# Altium project lab_1_somov_usb_i2c.PrjPcb
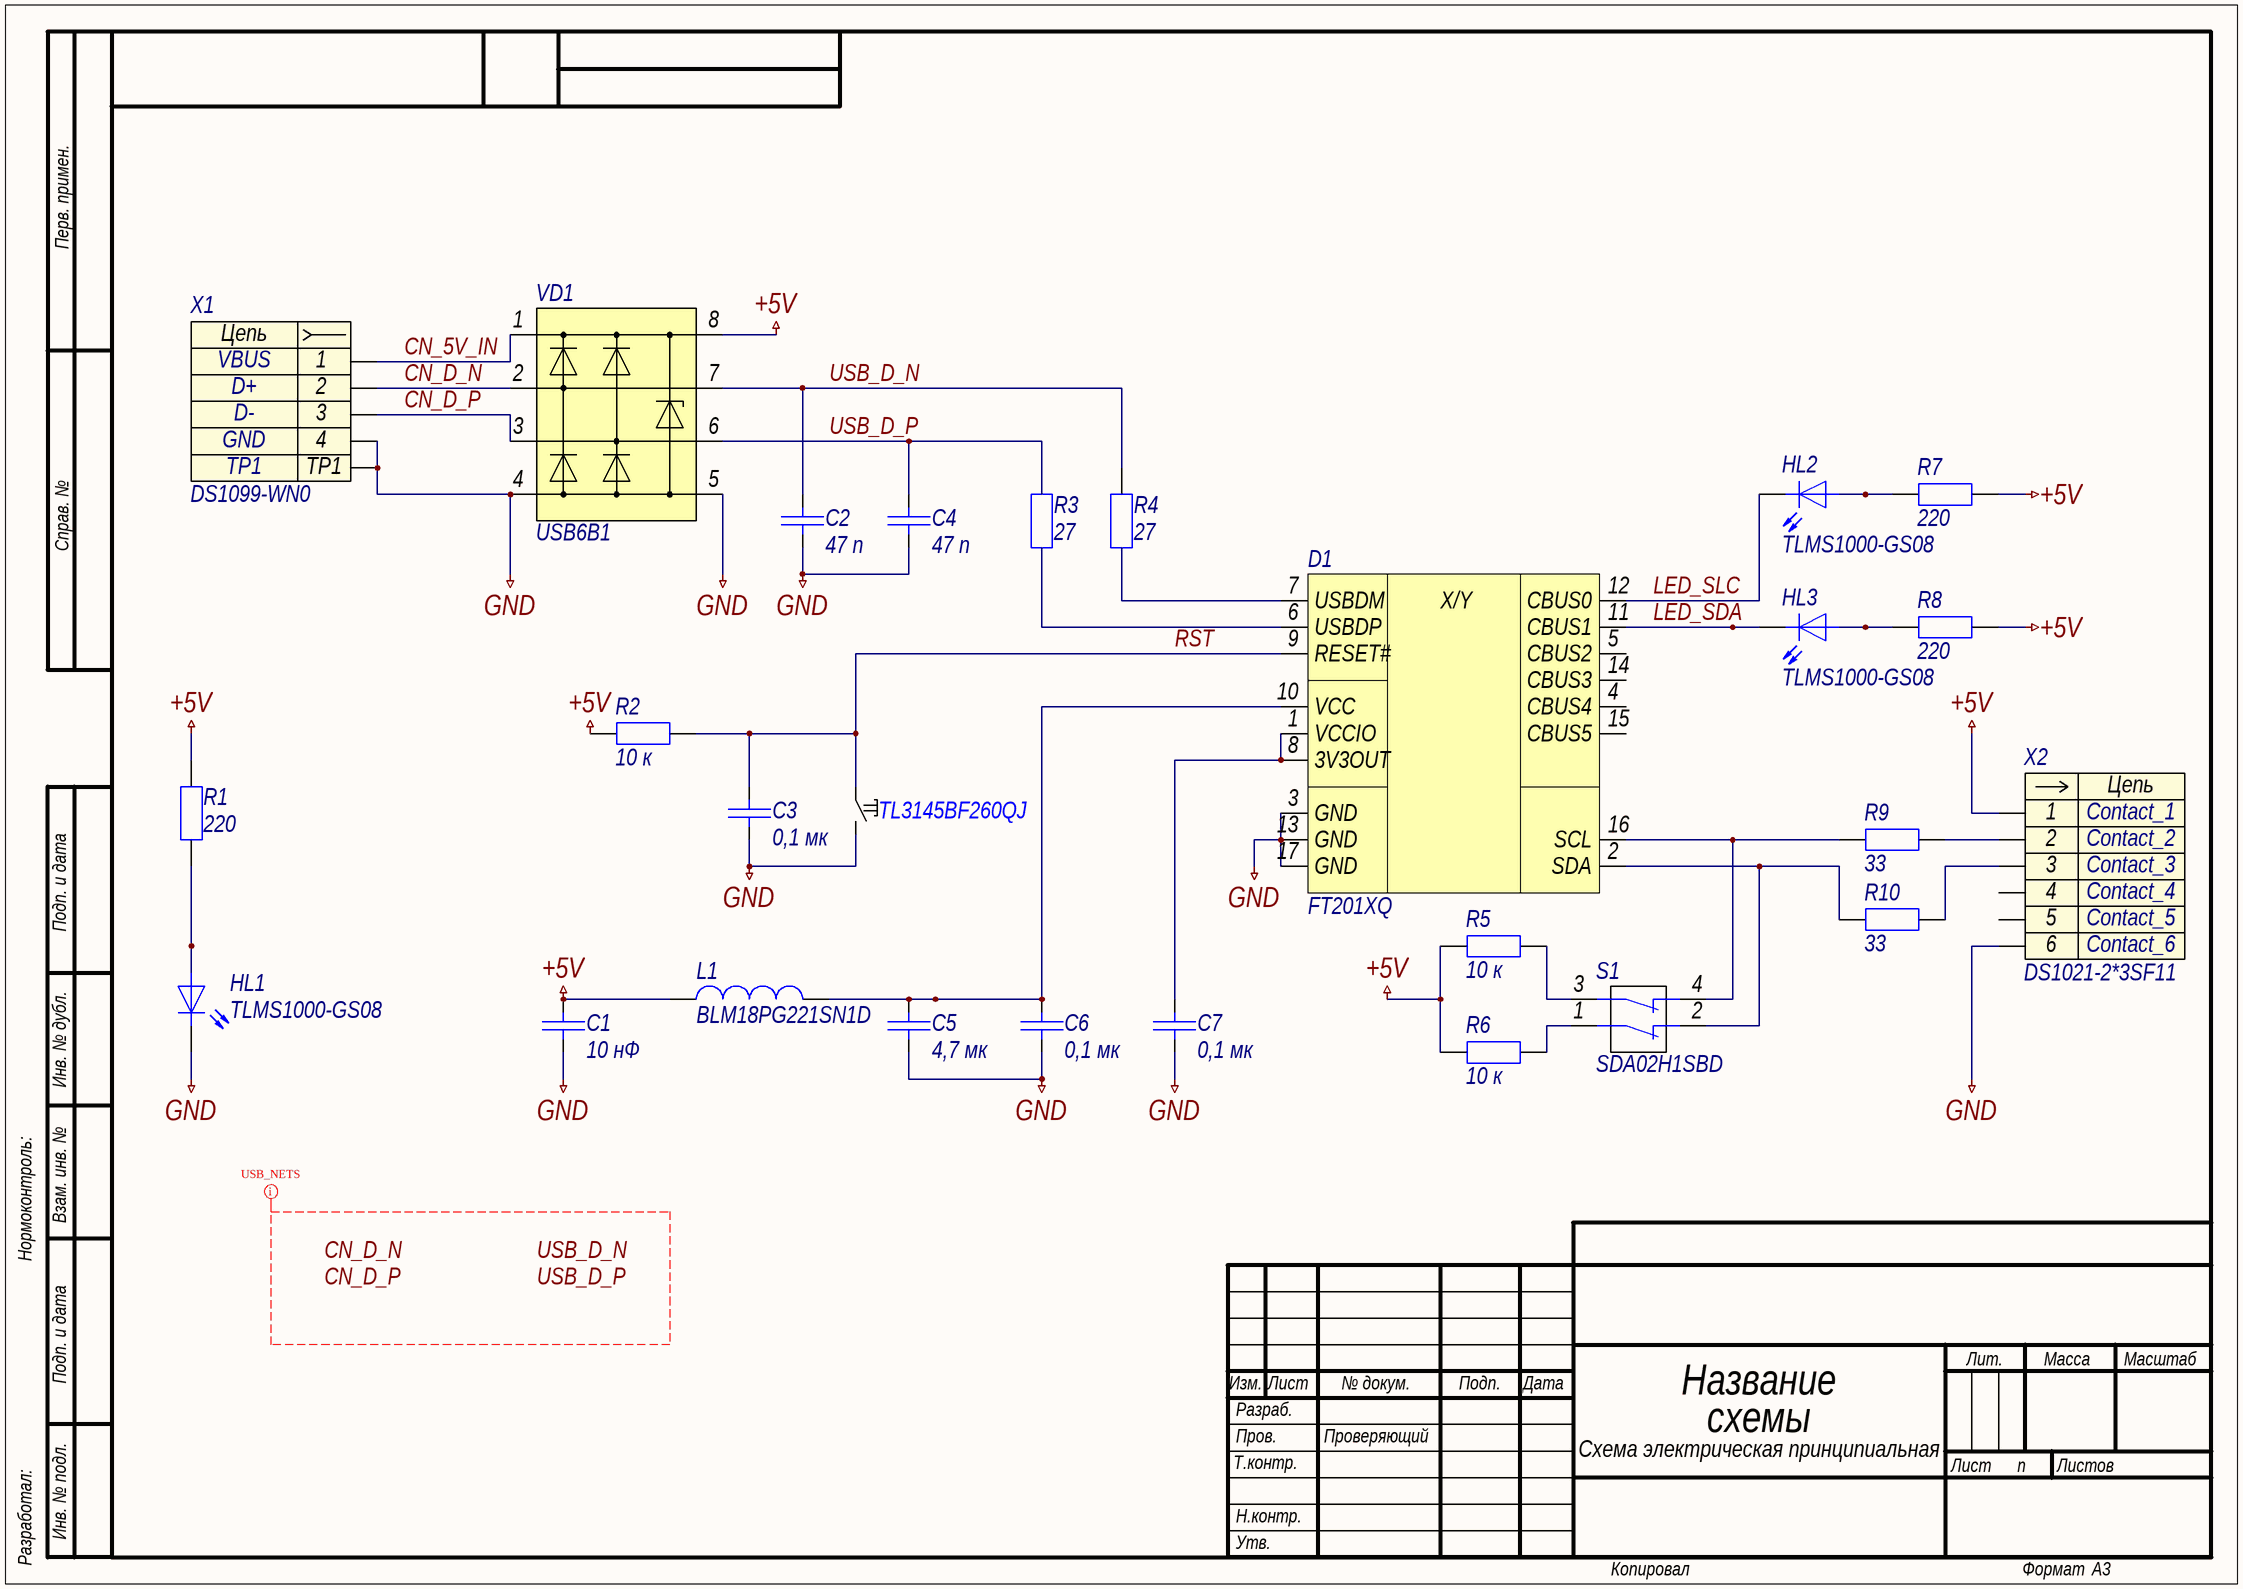
[diagram p0: lab_1_somov_usb_i2c.SchDoc]
approver: Утвердил; check: Проверяющий; designation: Введите номер сборки; developer: Разработчик; document_code: Ý3; document_type: Схема электрическая принципиальная; pcb_dec_number: Введите номер платы; project: Введите название проекта; sheets_total: M; title: Введите полное название схемы; title_line_1: Название; title_line_2: схемы
1 sheet, 27 parts. Net scope: global (net labels, ports and power ports of the same name join across sheets).
Board file: lab_1_somov_usb_i2c.PcbDoc

## Sheet lab_1_somov_usb_i2c.SchDoc: Введите полное название схемы
size 420 x 297 mm; ApprovedBy: Утвердил; CheckedBy: Проверяющий; DrawnBy: Разработчик; DocumentNumber: Ââåäèòå íîìåð ñáîðêèÝ3; SheetNumber: n; SheetTotal: M; DocumentCode: Ý3; ImagePath: Введите номер платы

### Parts
C1  10 нФ  [C0402]
C2  47 п  [C0201]
C3  0,1 мк  [C0603]
C4  47 п  [C0201]
C5  4,7 мк  [C0603]
C6  0,1 мк  [C0603]
C7  0,1 мк  [C0603]
D1  FT201XQ  [FT201XQ]
HL1  TLMS1000-GS08  [HL0603]
HL2  TLMS1000-GS08  [HL0603]
HL3  TLMS1000-GS08  [HL0603]
L1  BLM18PG221SN1D  [BLM-2-0603]
R1  220  [R0603]
R2  10 к  [R0603]
R3  27  [R27]
R4  27  [R27]
R5  10 к  [R0603]
R6  10 к  [R0603]
R7  220  [R0603]
R8  220  [R0603]
R9  33  [R0603]
R10  33  [R0603]
S1  SDA02H1SBD  [DIP-SWITCH-02-706X930X545]
TL3145BF260QJ  (no value)  [BUT: 3x4x2 SMT]
VD1  USB6B1  [SO-8]
X1  DS1099-WN0  [DS1099-WN0]
X2  DS1021-2*3SF11  [DS1021-2X3SF11]

### Nets
+5V: C1.1 L1.1 R1.2 R2.1 R5.1 R6.1 R7.2 R8.2 VD1.8 X2.1
GND: C1.2 C2.2 C3.2 C4.2 C5.2 C6.2 C7.2 D1.3(GND) D1.13(GND) D1.17(GND) HL1.1 TL3145BF260QJ.2 VD1.4 VD1.5 X1.4 X1.TP1 X2.6
CN_5V_IN: VD1.1 X1.1
CN_D_N: VD1.2 X1.2
CN_D_P: VD1.3 X1.3
LED_SDA: D1.11(CBUS1) HL3.1
LED_SLC: D1.12(CBUS0) HL2.1
RST: C3.1 D1.9(RESET#) R2.2 TL3145BF260QJ.1
USB_D_N: C2.1 VD1.7
USB_D_P: C4.1 R3.2 VD1.6
NetC5_1: C5.1 C6.1 D1.10(VCC) L1.2
NetC7_1: C7.1 D1.1(VCCIO) D1.8(3V3OUT)
NetD1_2: D1.2(SDA) R10.1 S1.2
NetD1_6: D1.6(USBDP) R3.1
NetD1_7: D1.7(USBDM) R4.1
NetD1_16: D1.16(SCL) R9.1 S1.4
NetHL1_2: HL1.2 R1.1
NetHL2_2: HL2.2 R7.1
NetHL3_2: HL3.2 R8.1
NetR5_2: R5.2 S1.3
NetR6_2: R6.2 S1.1
NetR9_2: R9.2 X2.2
NetR10_2: R10.2 X2.3

Not connected (* = marked no-connect by the designer): D1 4(CBUS4) 5(CBUS2) 14(CBUS3) 15(CBUS5); R4 2; X2 4 5

### Layout directives
rule Differential Pairs Routing [Pref Gap = 0.254mm    Min Gap  = 0.15mm    Max Gap  = 0.254mmPref Width = 0.381mm    Min Width  = 0.155mm    Max Width  = 0.381mm]; net class USB_SIGNALS: CN_D_N, CN_D_P, USB_D_N, USB_D_P

### Notes on the sheet
- Labels drawn without touching a wire or pin: CN_D_N, CN_D_P, USB_D_N, USB_D_P
- Перв. примен.
- Справ. №
- Подп. и дата
- Инв. № дубл.
- Нормоконтроль:
- Взам. инв. №
- Изм.
- Лист
- № докум.
- Подп.
- Дата
- Лит.
- Масса
- Масштаб
- Т.контр.
- Пров.
- Разраб.
- Листов
- Разработал:
- Инв. № подл.
- Н.контр.
- Утв.
- Копировал
- Формат
- А3
- (in symbol FT201XQ) X/Y
- (in symbol x0003) Цепь
- (in symbol x0005) Цепь

### Library data of the parts
C1 = c0004: =Описание; ID: c0004; Фамилия: Соколов; Описание: Конденсатор чип 0402 10 нФ 50 В ±10 %; Наименование: CL05B103KB5NNNC; Производитель: Samsung electro-mechanics; Отклонение: ±10 %; Номинальное напряжение: 50 В; Рабочие температуры: от -55 °С до +125 °С; Корпус: 0402; Номинал: 10 нФ; HelpURL: http://product.samsungsem.com/mlcc/CL05C101FB5NNN.do
C2 C4 = c0002: =Описание; ID: c0002; Фамилия: Козлов; Описание: Конденсатор чип 0201 47 пФ 25 В ±5 %; Наименование: CL03C470JA3NNNC; Производитель: Samsung electro-mechanics; Отклонение: ±5 %; Номинальное напряжение: 25 В; Рабочие температуры: от -55 °С до +125 °С; Корпус: 0201; Номинал: 47 п; HelpURL: http://product.samsungsem.com/mlcc/CL03C470JA3NNN.do
C3 C6 C7 = c0005: =Описание; ID: c0005; Фамилия: Ларионов; Описание: Конденсатор чип 0603 0,1 мкФ 50 В ±5 %; Наименование: CC0603JRX7R9BB104; Производитель: Yageo; Отклонение: ±5 %; Номинальное напряжение: 50 В; Рабочие температуры: от -55 °С до +125 °С; Корпус: 0603; Номинал: 0,1 мк; HelpURL: https://www.yageo.com/upload/media/product/products/datasheet/mlcc/UPY-GPHC_X7R_6.3V-to-50V_20.pdf
C5 = c0009: =Описание; ID: c0009; Фамилия: Ларионов; Описание: Конденсатор чип 0603 4,7 мкФ 25 В ±10 %; Наименование: CC0603KRX5R8BB475; Производитель: Yageo; Отклонение: ±10 %; Номинальное напряжение: 25 В; Рабочие температуры: от -55 °С до +85 °С; Корпус: 0603; Номинал: 4,7 мк; HelpURL: https://www.yageo.com/upload/media/product/productsearch/datasheet/mlcc/UPY-GPHC_X5R_4V-to-50V_26.pdf
HL1-HL3 = hl0001: =Описание; ID: hl0001; Фамилия: Ларионов; Описание: Светодиод чип 0603 красный; Производитель: Vishay Intertechnology, Inc.; Цвет: Red; Номинальная сила света: 4 мкд; Номинальная длина волны: 628 нм; Номинальный прямой ток: 15 мА; Номинальное падение напряжения: 1,8 В; Рассеиваемая мощность: 40 мВт; Рабочие температуры: от -40 °С до +100 °С; Корпус: 0603; Наименование: TLMS1000-GS08; HelpURL: https://www.vishay.com/leds/list/product-83172/
L1 = l0002: =Описание; ID: l0002; Фамилия: Самарин; Описание: Ферритовая бусина 220 Ом ±25 %; Производитель: Murata Manufacturing Co., Ltd.; Сопротивление, 100 МГц: 220 Ом; Отклонение, 100 Мгц: ±25 %; Сопротивление при постоянном токе: 0,1 Ом; Рабочие температуры: от -55 °С до +125 °С; Корпус: 0603; Наименование: BLM18PG221SN1D; HelpURL: https://www.murata.com/en-global/products/productdetail?partno=BLM18PG221SN1%23
R1 R7 R8 = r0008: =Описание; ID: r0008; Фамилия: Ларионов; Описание: Резистор чип 0603 220 Ом ±1 % 0,1 Вт; Наименование: RC0603FR-07220RL; Производитель: Yageo; Отклонение: ±1 %; Номинальное напряжение: 75 В; Рабочие температуры: от -55 °С до +155 °С; Номинальный ток: 1 А; Корпус: 0603; Номинал: 220; HelpURL: https://www.yageo.com/upload/media/product/productsearch/datasheet/rchip/PYu-RC_Group_51_RoHS_L_11.pdf
R2 R5 R6 = r0012: =Описание; ID: r0012; Фамилия: Самарин; Описание: Резистор чип 0603 10 кОм ±1 % 0,1 Вт; Наименование: RC0603FR-0710KL; Производитель: Yageo; Отклонение: ±1 %; Номинальное напряжение: 75 В; Рабочие температуры: от -55 °С до +155 °С; Номинальный ток: 1 А; Корпус: 0603; Номинал: 10 к; HelpURL: https://www.yageo.com/upload/media/product/productsearch/datasheet/rchip/PYu-RC_Group_51_RoHS_L_11.pdf
R3 R4 = R27
R9 R10 = r0005: =Описание; ID: r0005; Фамилия: Козлов; Описание: Резистор чип 0603 33 Ом ±1 % 0,1 Вт; Наименование: AA0603FR-0733RL; Производитель: Yageo; Отклонение: ±1 %; Номинальное напряжение: 75 В; Рабочие температуры: от -55 °С до +155 °С; Номинальный ток: 1 А; Корпус: 0603; Номинал: 33; HelpURL: https://www.yageo.com/upload/media/product/productsearch/datasheet/rchip/PYu-AA_51_RoHS_L_3.pdf
S1 = sw0001: =Описание; ID: sw0001; Фамилия: Козлов; Описание: 2-х позиционный движковый переключатель; Производитель: C&K; Ток нагрузки: 100 мА @ 5 В; Сопротивление контакта: 50 мОм; Количество контактов: 2; Рабочие температуры: от -40 °С до +85 °С; Промывка: Разрешена; Корпус: 7,06х9,30х5,45; Наименование: SDA02H1SBD; HelpURL: https://www.ckswitches.com/products/switches/product-details/DIP/SDA/SDA02H1SBD/
TL3145BF260QJ = Button_3x4x2_SMT: SMT 3*4*2 2PIN; Manufacturer: xin cheng electronic; HelpURL: https://aliexpress.ru/item/32309509976.html?spm=a2g0v.12010612.8148356.51.441f61b1yUlL0Q; ValueManufacturerPartNumber: =TypeButton+', '+Package; PartNumber: 3*4*2 2PIN; Package: 3*4*2mm
VD1 = vd0005: =Описание; ID: vd0005; Фамилия: Ларионов; Описание: Диодная сборка для подавления помех, от 6 В; Производитель: STMicroelectronics; Наименование: USB6B1; Корпус: SO-8; HelpURL: https://www.st.com/content/st_com/en/products/protection-devices/esd-protection/usb-port-protection/usb6b1.html
X1 = x0005: =Описание; Contact_1: VBUS; Contact_2: D+; Contact_3: D-; Contact_4: GND; ID: x0005; Фамилия: Самарин; Описание: USB Type B гнездо; Производитель: Connfly Electronic Co. LTD; Наименование: DS1099-WN0; HelpURL: http://www.connfly.com/productshow.aspx?id=407
X2 = x0003: =Описание; ID: x0003; Фамилия: Самарин; Описание: PLS 3x2 pin 2,54 мм вилка прямой; Производитель: Connfly Electronic Co. LTD; Contact_1: Contact_1; Contact_2: Contact_2; Contact_3: Contact_3; Contact_4: Contact_4; Contact_5: Contact_5; Contact_6: Contact_6; Наименование: DS1021-2*3SF11; HelpURL: http://www.connfly.com/productshow.aspx?id=118